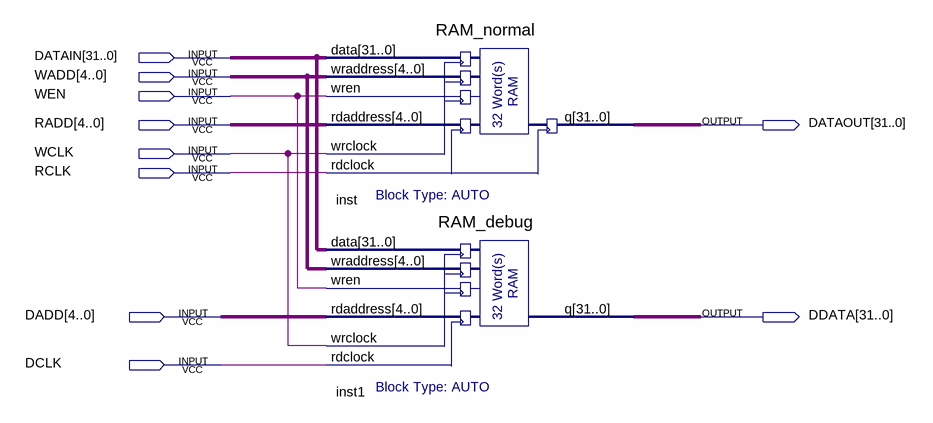
[diagram p0: schematic sheet]
// Quartus schematic dmemory.bdf as structural Verilog: 2 symbols, 10 pins
module dmemory (
  input  [31:0] DATAIN,
  input  [4:0] WADD,
  input  WEN,
  input  [4:0] RADD,
  input  WCLK,
  input  RCLK,
  input  [4:0] DADD,
  input  DCLK,
  output [31:0] DATAOUT,
  output [31:0] DDATA
);

  RAM_normal inst (
    .data(DATAIN), .wraddress(WADD), .wren(WEN), .rdaddress(RADD), .wrclock(WCLK), .rdclock(RCLK), .q(DATAOUT));
  RAM_debug inst1 (
    .data(DATAIN), .wraddress(WADD), .wren(WEN), .rdaddress(DADD), .wrclock(WCLK), .rdclock(DCLK), .q(DDATA));
endmodule
